# Altium schematic sheet Sheet1.SchDoc
size A4
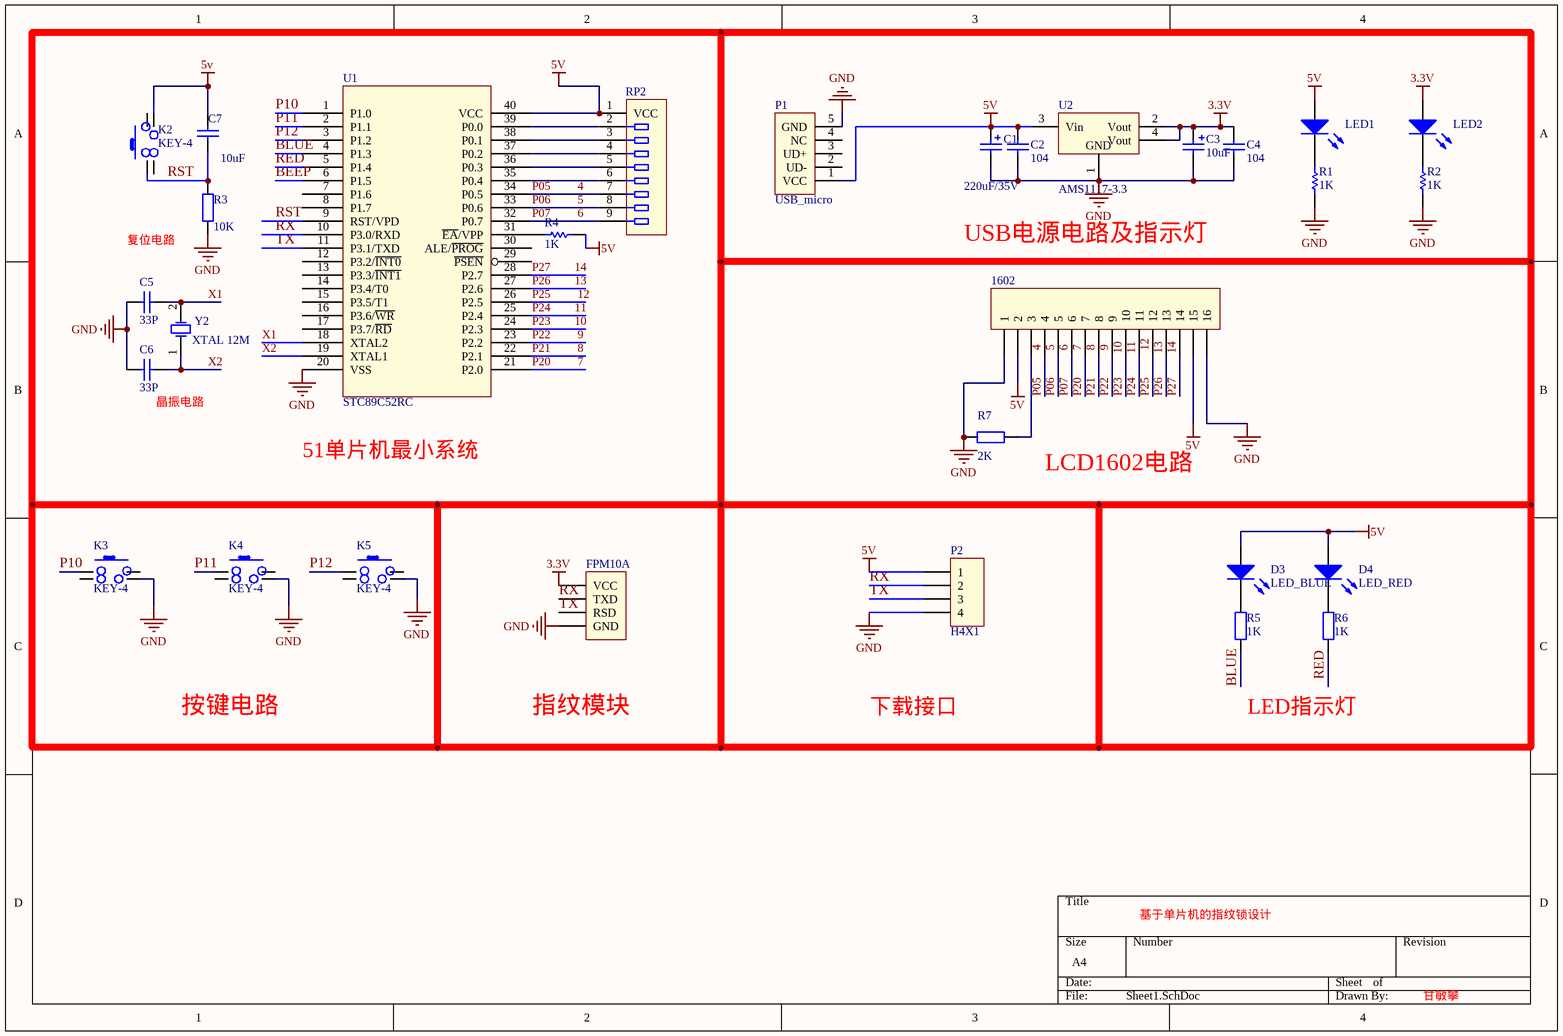
[diagram p0: Sheet1.SchDoc]

## Parts
1602  H16X1  [LCD1602]  (value not drawn)
C1  220uF/35V  [CAP POL [35V]]
C2  Cap  [CAP[0805]]  (value not drawn)
C3  Cap Pol  [CAP POL [16V]]  (value not drawn)
C4  Cap  [CAP[0805]]  (value not drawn)
C5  Cap  [CAP[0805]]  (value not drawn)
C6  Cap  [CAP[0805]]  (value not drawn)
C7  value 10uF  [CAP POL [16V]]  (hidden comment: Cap)
D3  LED_BLUE  [LED_BLUE]
D4  LED_RED  [LED_RED]
FPM10A  H4X1  [H2.54-1X4]  (value not drawn)
K2  KEY-4  [KEY-4]
K3  KEY-4  [KEY-4]
K4  KEY-4  [KEY-4]
K5  KEY-4  [KEY-4]
LED1  LED_RED  [LED[0805]]  (value not drawn)
LED2  LED_RED  [LED[0805]]  (value not drawn)
P1  USB_micro  [USB B mini 5pin]
P2  H4X1  [H2.54-1X4]
R1  Res1  [RES[0805]]  (value not drawn)
R2  Res1  [RES[0805]]  (value not drawn)
R3  value 10K  [RES[0805]]  (hidden comment: Res2)
R4  Res1  [RES[0805]]  (value not drawn)
R5  Res2  [RES[0805]]  (value not drawn)
R6  Res2  [RES[0805]]  (value not drawn)
R7  Res2  [Res]  (value not drawn)
RP2  (no value)  [RES-PACK]
U1  STC89C52RC  [STC89C52RC]
U2  AMS1117-3.3  [SOT-223(AMS1117-3.3)]
Y2  XTAL 12M  [XTAL]

## Nets
3.3V: C3.1 C4.2 FPM10A.1(VCC) LED2.1(A) U2.2(Vout) U2.4(Vout)
5V: 1602.2 1602.15 C1.1 C2.2 C7.2 D3.1(A) D4.1(A) K2.3 LED1.1(A) P1.1(VCC) P2.1 R4.2 RP2.1(VCC) U1.40(VCC) U2.3(Vin)
GND: 1602.1 1602.16 C1.2 C2.1 C3.2 C4.1 C5.1 C6.1 FPM10A.4(GND) K3.3 K4.3 K5.3 P1.5(GND) P2.4 R1.1 R2.1 R3.1 R7.1 U1.20(VSS) U2.1(GND)
BEEP: U1.6(P1.5)
BLUE: R5.1 U1.4(P1.3)
P05         4: 1602.4 RP2.7 U1.34(P0.5)
P06         5: 1602.5 RP2.8 U1.33(P0.6)
P07         6: 1602.6 RP2.9 U1.32(P0.7)
P10: K3.1 U1.1(P1.0)
P11: K4.1 U1.2(P1.1)
P12: K5.1 U1.3(P1.2)
P20         7: 1602.7 U1.21(P2.0)
P21         8: 1602.8 U1.22(P2.1)
P22         9: 1602.9 U1.23(P2.2)
P23        10: 1602.10 U1.24(P2.3)
P24        11: 1602.11 U1.25(P2.4)
P25         12: 1602.12 U1.26(P2.5)
P26        13: 1602.13 U1.27(P2.6)
P27        14: 1602.14 U1.28(P2.7)
RED: R6.1 U1.5(P1.4)
RST: C7.1 K2.1 R3.2 U1.9(RST/VPD)
RX: FPM10A.2(TXD) P2.2 U1.10(P3.0/RXD)
TX: FPM10A.3(RSD) P2.3 U1.11(P3.1/TXD)
X1: C5.2 U1.18(XTAL2) Y2.2(OSC2)
X2: C6.2 U1.19(XTAL1) Y2.1(OSC1)
Net1602_3: 1602.3 R7.2
NetD3_2: D3.2(K) R5.2
NetD4_2: D4.2(K) R6.2
NetLED1_2: LED1.2(K) R1.2
NetLED2_2: LED2.2(K) R2.2
NetR4_1: R4.1 U1.31(~{EA}/VPP)
NetRP2_2: RP2.2 U1.39(P0.0)
NetRP2_3: RP2.3 U1.38(P0.1)
NetRP2_4: RP2.4 U1.37(P0.2)
NetRP2_5: RP2.5 U1.36(P0.3)
NetRP2_6: RP2.6 U1.35(P0.4)

Not connected (* = marked no-connect by the designer): K2 2 4; K3 2 4; K4 2 4; K5 2 4; P1 2(UD-) 3(UD+) 4(NC); U1 7(P1.6) 8(P1.7) 12(P3.2/~{INT0}) 13(P3.3/~{INT1}) 14(P3.4/T0) 15(P3.5/T1) 16(P3.6/~{WR}) 17(P3.7/~{RD}) 29(~{PSEN}) 30(ALE/~{PROG})

## Notes on the sheet
- 51单片机最小系统
- 下载接口
- LED指示灯
- Labels drawn without touching a wire or pin: LCD1602电路, USB电源电路及指示灯, 基于单片机的指纹锁设计, 复位电路, 指纹模块, 按键电路, 晶振电路, 甘敏攀
- (in symbol Cap) 104; 33P
- (in symbol Cap Pol) 10uF
- (in symbol Res1) 1K
- (in symbol Res2) 2K; 1K

## Library data of the parts
C1 = Cap Pol [220uF/35V]
C7 = Cap: Capacitor; Published: 8-Jun-2000; LatestRevisionDate: 17-Jul-2002; LatestRevisionNote: Re-released for DXP Platform.; PackageReference: RAD-0.3; Publisher: Altium Limited; PackageDescription: Radial Cap, Thru-Hole; 2 Leads; 0.3 in Pin Spacing
D4 LED1 LED2 = LED_RED: LED1
K2-K5 = KEY-4: 4脚直插
R3 = Res2: Resistor; Published: 8-Jun-2000; LatestRevisionDate: 17-Jul-2002; LatestRevisionNote: Re-released for DXP Platform.; PackageReference: AXIAL-0.4; Publisher: Altium Limited; PackageDescription: Axial Device, Thru-Hole; 2 Leads; 0.4 in Pin Spacing
RP2 = Res-Pack
Y2 = XTAL